# Altium schematic sheet LED_STATUS.SchDoc
size A4; SheetNumber: 10; SheetTotal: 11
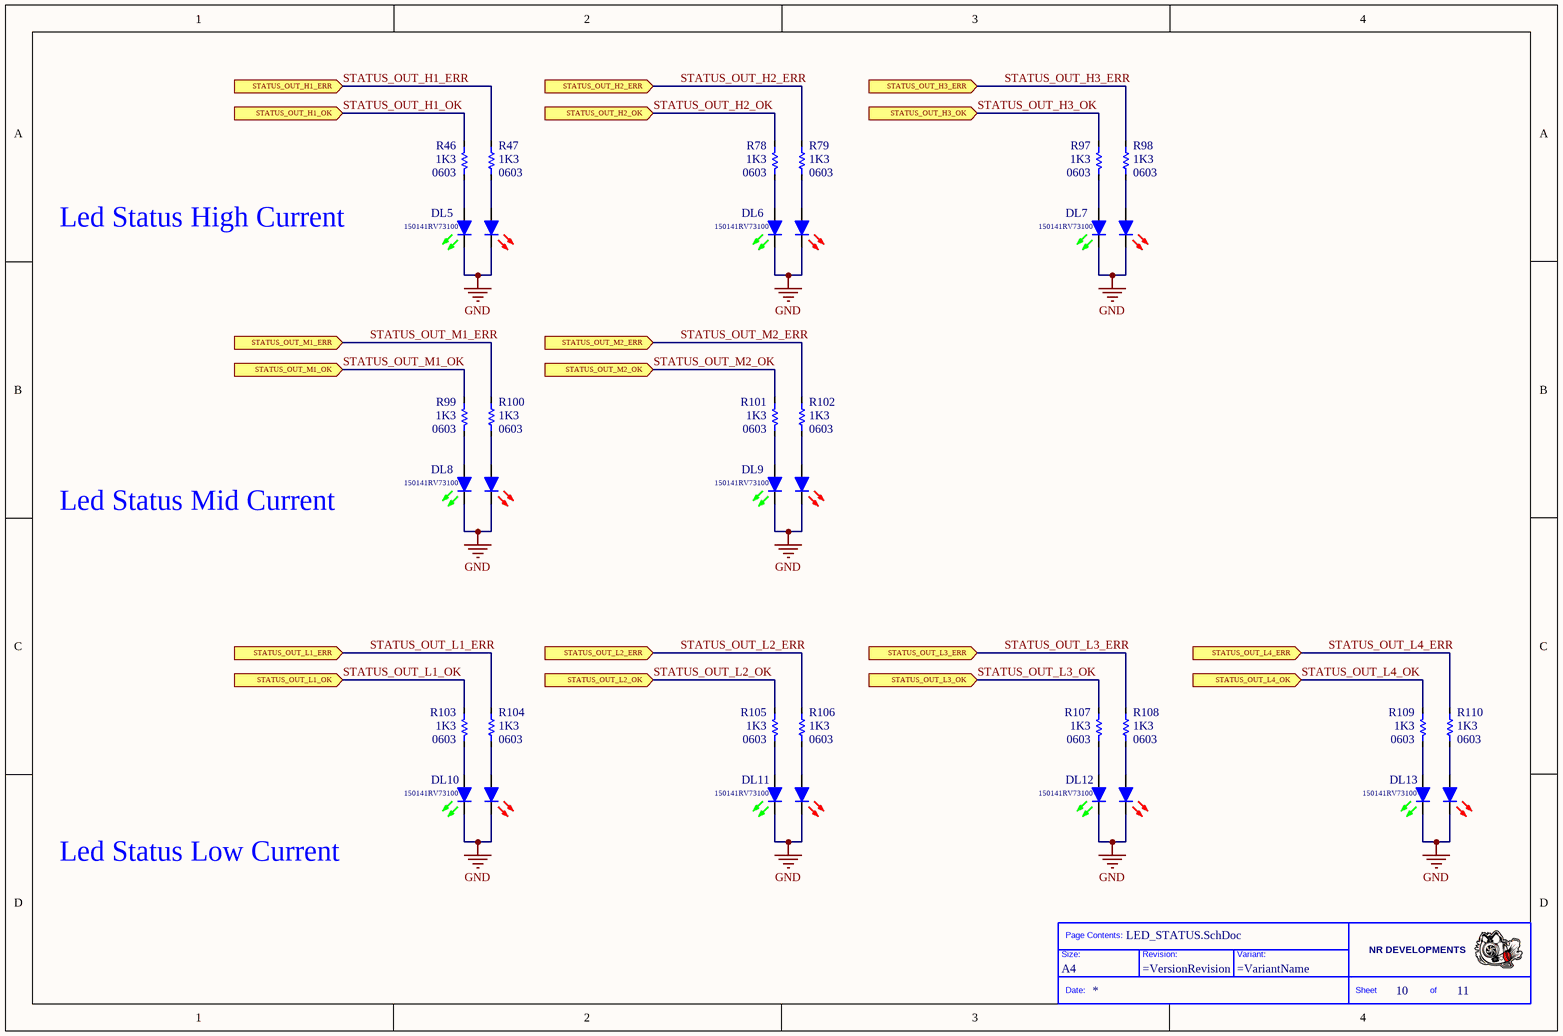
[diagram p0: LED_STATUS.SchDoc]

## Parts
*  Size: A4  (hidden comment: Title_Block)  (graphical)
DL5  value 150141RV73100  [WURTH-SBTW_3528]  (hidden comment: LED_Red_Green)
DL6  value 150141RV73100  [WURTH-SBTW_3528]  (hidden comment: LED_Red_Green)
DL7  value 150141RV73100  [WURTH-SBTW_3528]  (hidden comment: LED_Red_Green)
DL8  value 150141RV73100  [WURTH-SBTW_3528]  (hidden comment: LED_Red_Green)
DL9  value 150141RV73100  [WURTH-SBTW_3528]  (hidden comment: LED_Red_Green)
DL10  value 150141RV73100  [WURTH-SBTW_3528]  (hidden comment: LED_Red_Green)
DL11  value 150141RV73100  [WURTH-SBTW_3528]  (hidden comment: LED_Red_Green)
DL12  value 150141RV73100  [WURTH-SBTW_3528]  (hidden comment: LED_Red_Green)
DL13  value 150141RV73100  [WURTH-SBTW_3528]  (hidden comment: LED_Red_Green)
R46  value 1K3  Case: 0603  [RESC1608X06M]  (hidden comment: Res)
R47  value 1K3  Case: 0603  [RESC1608X06M]  (hidden comment: Res)
R78  value 1K3  Case: 0603  [RESC1608X06M]  (hidden comment: Res)
R79  value 1K3  Case: 0603  [RESC1608X06M]  (hidden comment: Res)
R97  value 1K3  Case: 0603  [RESC1608X06M]  (hidden comment: Res)
R98  value 1K3  Case: 0603  [RESC1608X06M]  (hidden comment: Res)
R99  value 1K3  Case: 0603  [RESC1608X06M]  (hidden comment: Res)
R100  value 1K3  Case: 0603  [RESC1608X06M]  (hidden comment: Res)
R101  value 1K3  Case: 0603  [RESC1608X06M]  (hidden comment: Res)
R102  value 1K3  Case: 0603  [RESC1608X06M]  (hidden comment: Res)
R103  value 1K3  Case: 0603  [RESC1608X06M]  (hidden comment: Res)
R104  value 1K3  Case: 0603  [RESC1608X06M]  (hidden comment: Res)
R105  value 1K3  Case: 0603  [RESC1608X06M]  (hidden comment: Res)
R106  value 1K3  Case: 0603  [RESC1608X06M]  (hidden comment: Res)
R107  value 1K3  Case: 0603  [RESC1608X06M]  (hidden comment: Res)
R108  value 1K3  Case: 0603  [RESC1608X06M]  (hidden comment: Res)
R109  value 1K3  Case: 0603  [RESC1608X06M]  (hidden comment: Res)
R110  value 1K3  Case: 0603  [RESC1608X06M]  (hidden comment: Res)

## Ports
STATUS_OUT_H1_ERR (in), STATUS_OUT_H1_OK (in), STATUS_OUT_H2_ERR (in), STATUS_OUT_H2_OK (in), STATUS_OUT_H3_ERR (in), STATUS_OUT_H3_OK (in), STATUS_OUT_L1_ERR (in), STATUS_OUT_L1_OK (in), STATUS_OUT_L2_ERR (in), STATUS_OUT_L2_OK (in), STATUS_OUT_L3_ERR (in), STATUS_OUT_L3_OK (in), STATUS_OUT_L4_ERR (in), STATUS_OUT_L4_OK (in), STATUS_OUT_M1_ERR (in), STATUS_OUT_M1_OK (in), STATUS_OUT_M2_ERR (in), STATUS_OUT_M2_OK (in)

## Nets
GND: DL5.C1 DL5.C2 DL6.C1 DL6.C2 DL7.C1 DL7.C2 DL8.C1 DL8.C2 DL9.C1 DL9.C2 DL10.C1 DL10.C2 DL11.C1 DL11.C2 DL12.C1 DL12.C2 DL13.C1 DL13.C2
STATUS_OUT_H1_ERR: R47.2 ; port STATUS_OUT_H1_ERR
STATUS_OUT_H1_OK: R46.2 ; port STATUS_OUT_H1_OK
STATUS_OUT_H2_ERR: R79.2 ; port STATUS_OUT_H2_ERR
STATUS_OUT_H2_OK: R78.2 ; port STATUS_OUT_H2_OK
STATUS_OUT_H3_ERR: R98.2 ; port STATUS_OUT_H3_ERR
STATUS_OUT_H3_OK: R97.2 ; port STATUS_OUT_H3_OK
STATUS_OUT_L1_ERR: R104.2 ; port STATUS_OUT_L1_ERR
STATUS_OUT_L1_OK: R103.2 ; port STATUS_OUT_L1_OK
STATUS_OUT_L2_ERR: R106.2 ; port STATUS_OUT_L2_ERR
STATUS_OUT_L2_OK: R105.2 ; port STATUS_OUT_L2_OK
STATUS_OUT_L3_ERR: R108.2 ; port STATUS_OUT_L3_ERR
STATUS_OUT_L3_OK: R107.2 ; port STATUS_OUT_L3_OK
STATUS_OUT_L4_ERR: R110.2 ; port STATUS_OUT_L4_ERR
STATUS_OUT_L4_OK: R109.2 ; port STATUS_OUT_L4_OK
STATUS_OUT_M1_ERR: R100.2 ; port STATUS_OUT_M1_ERR
STATUS_OUT_M1_OK: R99.2 ; port STATUS_OUT_M1_OK
STATUS_OUT_M2_ERR: R102.2 ; port STATUS_OUT_M2_ERR
STATUS_OUT_M2_OK: R101.2 ; port STATUS_OUT_M2_OK
NetDL5_A1: DL5.A1 R47.1
NetDL5_A2: DL5.A2 R46.1
NetDL6_A1: DL6.A1 R79.1
NetDL6_A2: DL6.A2 R78.1
NetDL7_A1: DL7.A1 R98.1
NetDL7_A2: DL7.A2 R97.1
NetDL8_A1: DL8.A1 R100.1
NetDL8_A2: DL8.A2 R99.1
NetDL9_A1: DL9.A1 R102.1
NetDL9_A2: DL9.A2 R101.1
NetDL10_A1: DL10.A1 R104.1
NetDL10_A2: DL10.A2 R103.1
NetDL11_A1: DL11.A1 R106.1
NetDL11_A2: DL11.A2 R105.1
NetDL12_A1: DL12.A1 R108.1
NetDL12_A2: DL12.A2 R107.1
NetDL13_A1: DL13.A1 R110.1
NetDL13_A2: DL13.A2 R109.1

## Notes on the sheet
- Led Status High Current
- Led Status Mid Current
- Led Status Low Current
- (in symbol Title_Block) Page Contents:; NR DEVELOPMENTS; Size:; Revision:; Variant:; Date:; Sheet; of

## Library data of the parts
DL5-DL13 = LED_Red_Green: Led Red - Green 3528; Manufacturer: Wurth; PartNumber: 150141RV73100; Case: 3528
R46 R47 R78 R79 R97-R110 = Resistor: Manufacturer: Vishay; PartNumber: RC0603FR-071K3L; SMD/PTH: SMD